# Altium project IMU V1.PrjPcb
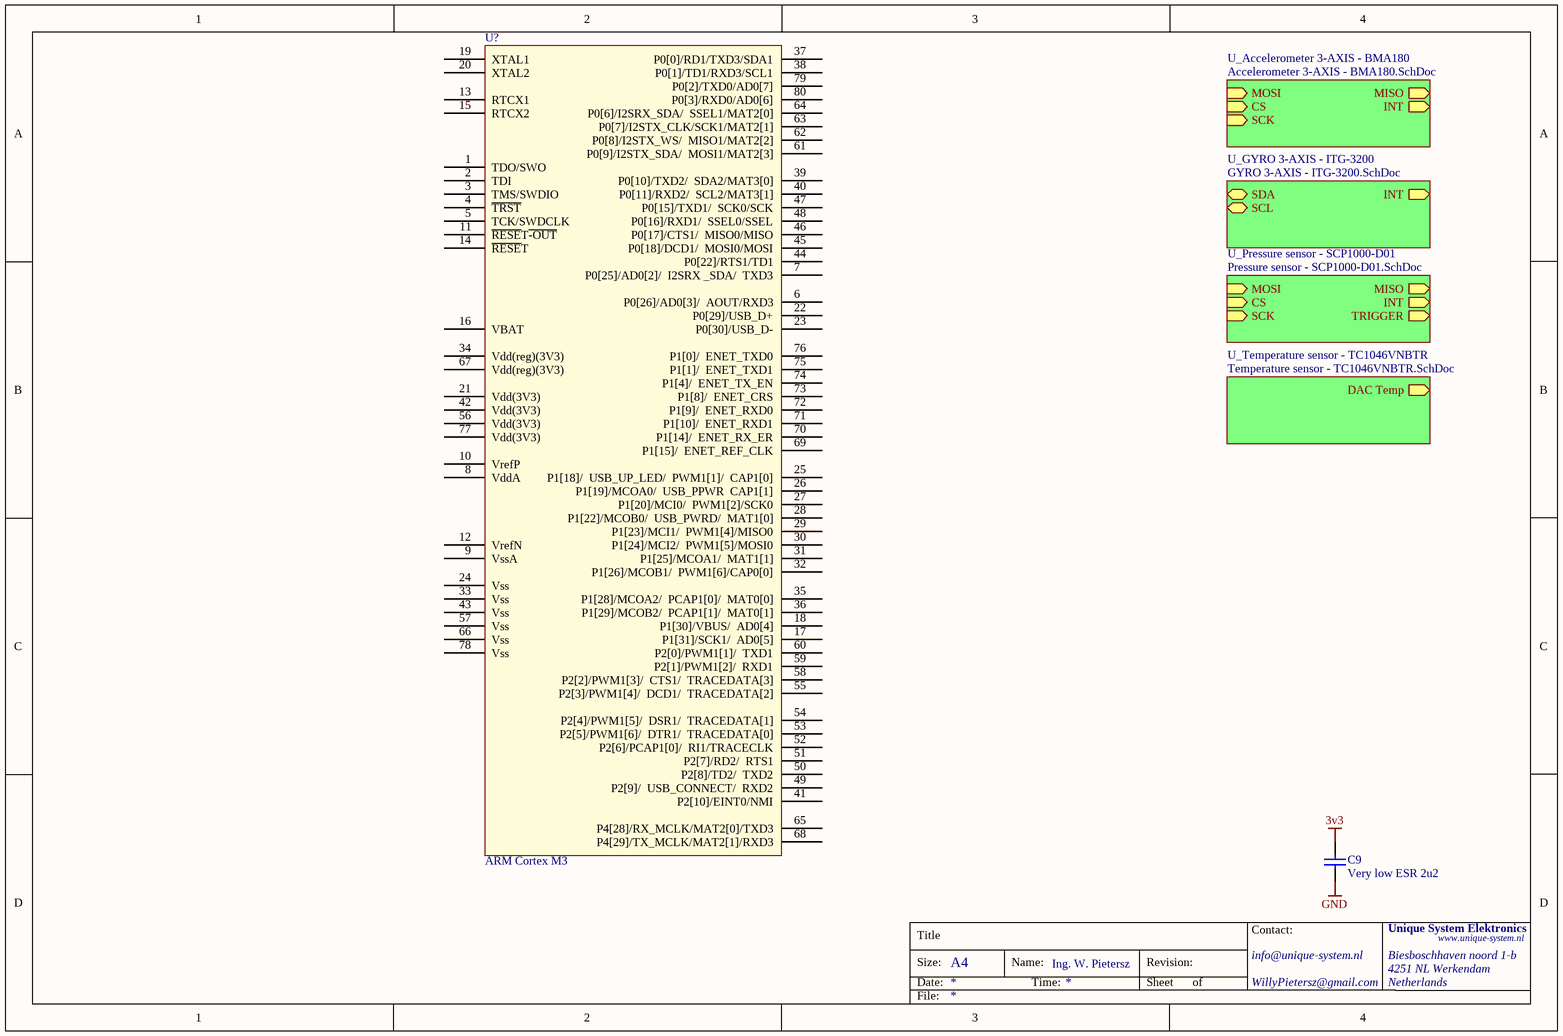
[diagram p0: main.SchDoc]
6 sheets, 16 parts. Net scope: hierarchical (ports join the sheet entries above them; power ports are global).
Board file: IMU V1.PcbDoc
Sheets:
  main.SchDoc
    U_GYRO 3-AXIS - ITG-3200 = GYRO 3-AXIS - ITG-3200.SchDoc
    U_Pressure sensor - SCP1000-D01 = Pressure sensor - SCP1000-D01.SchDoc
    U_Temperature sensor - TC1046VNBTR = Temperature sensor - TC1046VNBTR.SchDoc
  Zigbee interface.SchDoc
  JTAG Connector.SchDoc

## Sheet main.SchDoc
size A4; Organization: Altium Limited; Address1: 3 Minna Close; Address2: Belrose; Address3: NSW 2085; Address4: Australia

### Parts
(Parts that share a designator on the sheet are numbered #1, #2 ... from top to bottom, then left to right.)
C9  Very low ESR 2u2  [C1210]
U?#1  ARM Cortex M3  [LQFP80]

### Sub-sheets
U_Accelerometer 3-AXIS - BMA180 = Accelerometer 3-AXIS - BMA180.SchDoc (file not in this document): MOSI (in), MISO (out), CS (in), SCK (in), INT (out)
U_GYRO 3-AXIS - ITG-3200 = GYRO 3-AXIS - ITG-3200.SchDoc: SDA (bidir), SCL (bidir), INT (out)
U_Pressure sensor - SCP1000-D01 = Pressure sensor - SCP1000-D01.SchDoc: MOSI (in), MISO (out), CS (in), SCK (in), INT (out), TRIGGER (out)
U_Temperature sensor - TC1046VNBTR = Temperature sensor - TC1046VNBTR.SchDoc: DAC Temp (out)

### Nets
3v3: C9.2
GND: C9.1

Not connected (* = marked no-connect by the designer): U?#1 1(TDO/SWO) 2(TDI) 3(TMS/SWDIO) 4(~{TRST}) 5(TCK/SWDCLK) 6(P0[26]/AD0[3]/__AOUT/RXD3) 7(P0[25]/AD0[2]/__I2SRX__SDA/__TXD3) 8(VddA) 9(VssA) 10(VrefP) 11(~{RESE}T~{-OUT}) 12(VrefN) 13(RTCX1) 14(~{RESE}T) 15(RTCX2) 16(VBAT) 17(P1[31]/SCK1/__AD0[5]) 18(P1[30]/VBUS/__AD0[4]) 19(XTAL1) 20(XTAL2) 21(Vdd(3V3)) 22(P0[29]/USB_D+) 23(P0[30]/USB_D-) 24(Vss) 25(P1[18]/__USB_UP_LED/__PWM1[1]/__CAP1[0]) 26(P1[19]/MCOA0/__USB_PPWR__CAP1[1]) 27(P1[20]/MCI0/__PWM1[2]/SCK0) 28(P1[22]/MCOB0/__USB_PWRD/__MAT1[0]) 29(P1[23]/MCI1/__PWM1[4]/MISO0) 30(P1[24]/MCI2/__PWM1[5]/MOSI0) 31(P1[25]/MCOA1/__MAT1[1]) 32(P1[26]/MCOB1/__PWM1[6]/CAP0[0]) 33(Vss) 34(Vdd(reg)(3V3)) 35(P1[28]/MCOA2/__PCAP1[0]/__MAT0[0]) 36(P1[29]/MCOB2/__PCAP1[1]/__MAT0[1]) 37(P0[0]/RD1/TXD3/SDA1) 38(P0[1]/TD1/RXD3/SCL1) 39(P0[10]/TXD2/__SDA2/MAT3[0]) 40(P0[11]/RXD2/__SCL2/MAT3[1]) 41(P2[10]/EINT0/NMI) 42(Vdd(3V3)) 43(Vss) 44(P0[22]/RTS1/TD1) 45(P0[18]/DCD1/__MOSI0/MOSI) 46(P0[17]/CTS1/__MISO0/MISO) 47(P0[15]/TXD1/__SCK0/SCK) 48(P0[16]/RXD1/__SSEL0/SSEL) 49(P2[9]/__USB_CONNECT/__RXD2) 50(P2[8]/TD2/__TXD2) 51(P2[7]/RD2/__RTS1) 52(P2[6]/PCAP1[0]/__RI1/TRACECLK) 53(P2[5]/PWM1[6]/__DTR1/__TRACEDATA[0]) 54(P2[4]/PWM1[5]/__DSR1/__TRACEDATA[1]) 55(P2[3]/PWM1[4]/__DCD1/__TRACEDATA[2]) 56(Vdd(3V3)) 57(Vss) 58(P2[2]/PWM1[3]/__CTS1/__TRACEDATA[3]) 59(P2[1]/PWM1[2]/__RXD1) 60(P2[0]/PWM1[1]/__TXD1) 61(P0[9]/I2STX_SDA/__MOSI1/MAT2[3]) 62(P0[8]/I2STX_WS/__MISO1/MAT2[2]) 63(P0[7]/I2STX_CLK/SCK1/MAT2[1]) 64(P0[6]/I2SRX_SDA/__SSEL1/MAT2[0]) 65(P4[28]/RX_MCLK/MAT2[0]/TXD3) 66(Vss) 67(Vdd(reg)(3V3)) 68(P4[29]/TX_MCLK/MAT2[1]/RXD3) 69(P1[15]/__ENET_REF_CLK) 70(P1[14]/__ENET_RX_ER) 71(P1[10]/__ENET_RXD1) 72(P1[9]/__ENET_RXD0) 73(P1[8]/__ENET_CRS) 74(P1[4]/__ENET_TX_EN) 75(P1[1]/__ENET_TXD1) 76(P1[0]/__ENET_TXD0) 77(Vdd(3V3)) 78(Vss) 79(P0[2]/TXD0/AD0[7]) 80(P0[3]/RXD0/AD0[6])

### Notes on the sheet
- Title
- Size:
- Date:
- A4
- Name:
- Time:
- Ing. W. Pietersz
- Revision:
- Sheet
- of
- WillyPietersz@gmail.com
- Contact:
- info@unique-system.nl
- Unique System Elektronics
- Biesboschhaven noord 1-b
- 4251 NL Werkendam
- Netherlands
- www.unique-system.nl
- File:

### Library data of the parts
C9 = 2.2uF-1210-X7R: Voltage: 50V; Type: X7R; Tolerance: 0.1; Part Number: 2.2uF-1210-X7R; Value: 2.2uF-1210-X7R; Package: 1210; Component Type: Low ESR; LatestRevision Date: 14-9-2010; Author: Willem Pietersz; Supplier 2: Farnell; Supplier Part Number 2: 1414066
U?#1 = LPC175x: Part Number: LPC175x; Component Type: UC, ARM; Supplier 2: Farnell; Supplier Part Number 2: 1718541; ComponentLink1Description: Datasheet; ComponentLink1URL: http://www.nxp.com/acrobat/datasheets/LPC1758_56_54_52_51_2.pdf

## Sheet GYRO 3-AXIS - ITG-3200.SchDoc
size A4; Organization: Altium Limited; Address1: 3 Minna Close; Address2: Belrose; Address3: NSW 2085; Address4: Australia
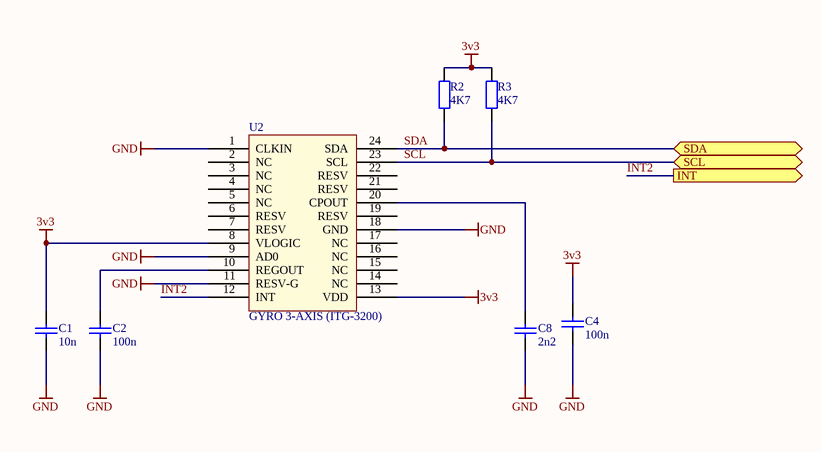
[diagram p1: GYRO 3-AXIS - ITG-3200.SchDoc]

### Parts
C1  10n  [C0805]
C2  100n  [C0805]
C4  100n  [C0805]
C8  2n2  [C0805]
R2  value 4K7  [R0805]  (hidden comment: RESISTOR)
R3  value 4K7  [R0805]  (hidden comment: RESISTOR)
U2  GYRO 3-AXIS (ITG-3200)  [QFN50P400X400-24V2M - GYRO 3axis]

### Ports
INT (out), SCL (bidir), SDA (bidir)

### Nets
3v3: C1.2 C4.2 R2.1 R3.1 U2.8(VLOGIC) U2.13(VDD)
GND: C1.1 C2.1 C4.1 C8.1 U2.1(CLKIN) U2.9(AD0) U2.11(RESV-G) U2.18(GND)
INT2: U2.12(INT) ; port INT
SCL: R3.2 U2.23(SCL) ; port SCL
SDA: R2.2 U2.24(SDA) ; port SDA
NetC2_2: C2.2 U2.10(REGOUT)
NetC8_2: C8.2 U2.20(CPOUT)

Not connected (* = marked no-connect by the designer): U2 2(NC) 3(NC) 4(NC) 5(NC) 6(RESV) 7(RESV) 14(NC) 15(NC) 16(NC) 17(NC) 19(RESV) 21(RESV) 22(RESV)

### Notes on the sheet
- Title
- Size:
- Date:
- A4
- Name:
- Time:
- Ing. W. Pietersz
- Revision:
- Sheet
- of
- WillyPietersz@gmail.com
- Contact:
- info@unique-system.nl
- Unique System Elektronics
- Biesboschhaven noord 1-b
- 4251 NL Werkendam
- Netherlands
- www.unique-system.nl
- File:

### Library data of the parts
C1 = 10n: Tolerance: 0.1; LatestRevision Note: Initial Release; Part Number: 10n; Value: 10n; Package: 0805; Component Type: Standard; LatestRevision Date: 31-7-2010; Author: Willy Pietersz; ComponentLink1Description: Manufacturer; ComponentLink2Description: Datasheet
C2 C4 = 100n: Tolerance: 0.1; LatestRevision Note: Initial Release; Part Number: 100n; Value: 100n; Package: 0805; Component Type: Standard; LatestRevision Date: 31-7-2010; Author: Willy Pietersz; Supplier 2: Farnell; Supplier Part Number 2: 1759266; ComponentLink1Description: Manufacturer; ComponentLink2Description: Datasheet
C8 = 2n2: Tolerance: 0.1; LatestRevision Note: Initial Release; Part Number: 2n2; Value: 2n2; Package: 0805; Component Type: Standard; LatestRevision Date: 31-7-2010; Author: Willy Pietersz; ComponentLink1Description: Manufacturer; ComponentLink2Description: Datasheet
R2 R3 = 4K7: Manufacturer 1: Panasonic; Manufacturer 1 Part No: ERJT06J472V; Power: 0.25W; Tolerance: 0.05; LatestRevision Note: Initial Release; Published: 8-Jun-2000; LatestRevisionDate: 17-Jul-2002; LatestRevisionNote: Re-released for DXP Platform.; PackageReference: AXIAL-0.4; Publisher: Altium Limited; Part Number: 4K7; Type: Film; Package: 0805; Component Type: Standard; LatestRevision Date: 30-7-2010; Author: Willy Pietersz; ROHS: Y; Supplier 2: Farnell; Supplier Part Number 2: 1577368; ComponentLink1Description: Manufacturer; ComponentLink2Description: Datasheet
U2 = ITG-3200: Gyro, 3-axis; Part Number: ITG-3200; Component Type: Sensor; Supplier 1: Sparkfun; Supplier Part Number 1: ITG-3200; ComponentLink1Description: Datasheet; ComponentLink1URL: http://www.sparkfun.com/datasheets/Sensors/Gyro/PS-ITG-3200-00-01.4.pdf

## Sheet Pressure sensor - SCP1000-D01.SchDoc
size A4; Organization: Altium Limited; Address1: 3 Minna Close; Address2: Belrose; Address3: NSW 2085; Address4: Australia
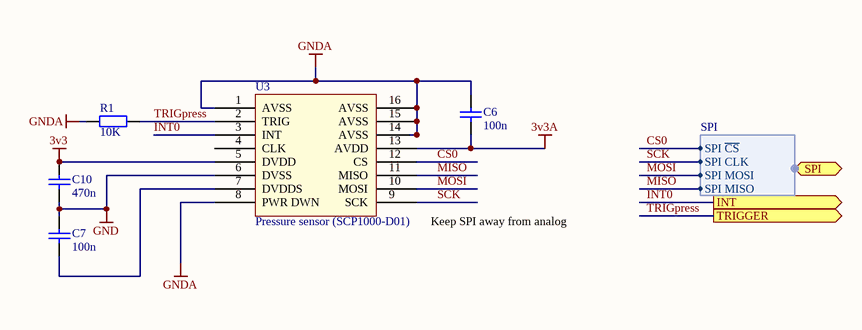
[diagram p2: Pressure sensor - SCP1000-D01.SchDoc]

### Parts
C6  100n  [C0805]
C7  100n  [C0805]
C10  470n  [C0805]
R1  value 10K  [R0805]  (hidden comment: RESISTOR)
U3  Pressure sensor (SCP1000-D01)  [SCP1000-D01]

### Ports
INT (out), SPI (harness SPI), TRIGGER (out)

### Harnesses
SPI: SPI ~{CS}, SPI CLK, SPI MOSI, SPI MISO

### Nets
3v3: C10.2 U3.5(DVDD)
3v3A: C6.1 U3.13(AVDD)
GND: C7.2 C10.1 U3.6(DVSS)
GNDA: C6.2 R1.1 U3.1(AVSS) U3.8(PWR_DWN) U3.14(AVSS) U3.15(AVSS) U3.16(AVSS)
CS0: U3.12(CS) ; port SPI.SPI ~{CS}
INT0: U3.3(INT) ; port INT
MISO: U3.11(MISO) ; port SPI.SPI MISO
MOSI: U3.10(MOSI) ; port SPI.SPI MOSI
SCK: U3.9(SCK) ; port SPI.SPI CLK
TRIGpress: R1.2 U3.2(TRIG) ; port TRIGGER
NetC7_1: C7.1 U3.7(DVDDS)

Not connected (* = marked no-connect by the designer): U3 4(CLK)

### Notes on the sheet
- Keep SPI away from analog
- Title
- Size:
- Date:
- A4
- Name:
- Time:
- Ing. W. Pietersz
- Revision:
- Sheet
- of
- WillyPietersz@gmail.com
- Contact:
- info@unique-system.nl
- Unique System Elektronics
- Biesboschhaven noord 1-b
- 4251 NL Werkendam
- Netherlands
- www.unique-system.nl
- File:

### Library data of the parts
C6 C7 = 100n: as C2 on sheet GYRO 3-AXIS - ITG-3200; Part Number: 100n; Value: 100n; Package: 0805; Component Type: Standard; LatestRevision Date: 31-7-2010; Author: Willy Pietersz; Supplier 2: Farnell; Supplier Part Number 2: 1759266; ComponentLink1Description: Manufacturer; ComponentLink2Description: Datasheet
C10 = 470n: Tolerance: 0.1; LatestRevision Note: Initial Release; Part Number: 470n; Value: 470n; Package: 0805; Component Type: Standard; LatestRevision Date: 31-7-2010; Author: Willy Pietersz; ComponentLink1Description: Manufacturer; ComponentLink2Description: Datasheet
R1 = 10K: Manufacturer 1: Panasonic; Manufacturer 1 Part No: ERJT06J103V; Power: 0.25W; Tolerance: 0.05; LatestRevision Note: Initial Release; Published: 8-Jun-2000; LatestRevisionDate: 17-Jul-2002; LatestRevisionNote: Re-released for DXP Platform.; PackageReference: AXIAL-0.4; Publisher: Altium Limited; Part Number: 10K; Type: Film; Package: 0805; Component Type: Standard; LatestRevision Date: 30-7-2010; Author: Willy Pietersz; ROHS: Y; Supplier 2: Farnell; Supplier Part Number 2: 1618242; ComponentLink1Description: Manufacturer; ComponentLink2Description: Datasheet
U3 = SCP1000-D01: Part Number: SCP1000-D01; Component Type: Sensor; Supplier 1: Sparkfun; Supplier Part Number 1: SCP1000-D01; ComponentLink1Description: Datasheet; ComponentLink1URL: http://www.sparkfun.com/datasheets/Components/SCP1000-D01.pdf

## Sheet Temperature sensor - TC1046VNBTR.SchDoc
size A4; Organization: Altium Limited; Address1: 3 Minna Close; Address2: Belrose; Address3: NSW 2085; Address4: Australia
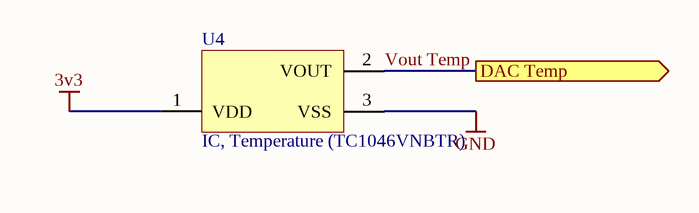
[diagram p3: Temperature sensor - TC1046VNBTR.SchDoc]

### Parts
U4  IC, Temperature (TC1046VNBTR)  [SOT-23-NB3_M]

### Ports
DAC Temp (out)

### Nets
3v3: U4.1(VDD)
GND: U4.3(VSS)
Vout Temp: U4.2(VOUT) ; port DAC Temp

### Notes on the sheet
- Title
- Size:
- Date:
- A4
- Name:
- Time:
- Ing. W. Pietersz
- Revision:
- Sheet
- of
- WillyPietersz@gmail.com
- Contact:
- info@unique-system.nl
- Unique System Elektronics
- Biesboschhaven noord 1-b
- 4251 NL Werkendam
- Netherlands
- www.unique-system.nl
- File:

### Library data of the parts
U4 = TC1046VNBTR: High Precision Temperature-to-Voltage Converter, 3-Pin SOT-23, Extended Temperature, Tape and Reel; FirstPublished: 29-Jan-2009; DatasheetVersion: revB, Feb-2003; PackageVersion: revBB, Aug-2009; PackageReference: SOT-23-NB3; Publisher: Altium Limited; PackageDescription: 3-Lead Plastic Small Outline Transistor (NB) [SOT-23]; Supplier 1: Digi-Key; Supplier Part Number 1: TC1046VNBTRTR-ND; Supplier 2: Digi-Key; Supplier Part Number 2: TC1046VNBTRCT-ND; Supplier 3: Digi-Key; Supplier Part Number 3: TC1046VNBTRDKR-ND; Supplier 4: Farnell; Supplier Part Number 4: 1212685; Supplier 5: Newark; Supplier Part Number 5: 89C8092; Code_IPC: SOT23-3; ComponentLink1Description: Datasheet; ComponentLink1URL: http://ww1.microchip.com/downloads/en/DeviceDoc/21496b.pdf; ComponentLink2Description: Packaging Specification; ComponentLink2URL: http://www.microchip.com/stellent/groups/techpub_sg/documents/packagingspec/en012702.pdf; ComponentLink3Description: Microchip.com Home; ComponentLink3URL: http://www.microchip.com/

## Sheet Zigbee interface.SchDoc
size A4; Organization: Altium Limited; Address1: 3 Minna Close; Address2: Belrose; Address3: NSW 2085; Address4: Australia
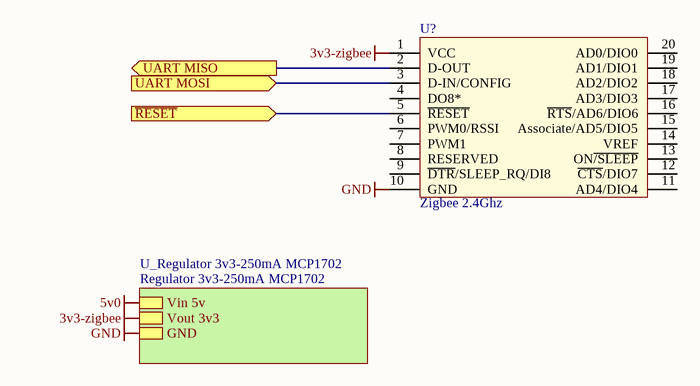
[diagram p4: Zigbee interface.SchDoc]

### Parts
(Parts that share a designator on the sheet are numbered #1, #2 ... from top to bottom, then left to right.)
U?#2  Zigbee 2.4Ghz  [Zigbee_maxstream]

### Sub-sheets
U_Regulator 3v3-250mA MCP1702 = Regulator 3v3-250mA MCP1702 (file not in this document): Vin 5v, Vout 3v3, GND

### Ports
UART MISO (out), UART MOSI (in), ~{RESET} (in)

### Nets
3v3-zigbee: U?#2.1(VCC) ; sheet U_Regulator 3v3-250mA MCP1702/Vout 3v3
5v0: sheet U_Regulator 3v3-250mA MCP1702/Vin 5v
GND: U?#2.10(GND) ; sheet U_Regulator 3v3-250mA MCP1702/GND
NetU?#2_2: U?#2.2(D-OUT) ; port UART MISO
NetU?#2_3: U?#2.3(D-IN/CONFIG) ; port UART MOSI
NetU?#2_5: U?#2.5(~{RESET}) ; port ~{RESET}

Not connected (* = marked no-connect by the designer): U?#2 4(DO8*) 6(PWM0/RSSI) 7(PWM1) 8(RESERVED) 9(~{DTR}/SLEEP_RQ/DI8) 11(AD4/DIO4) 12(~{CTS}/DIO7) 13(ON~{/SLEEP}) 14(VREF) 15(Associate/AD5/DIO5) 16(~{RTS}/AD6/DIO6) 17(AD3/DIO3) 18(AD2/DIO2) 19(AD1/DIO1) 20(AD0/DIO0)

### Notes on the sheet
- Title
- Size:
- Date:
- A4
- Name:
- Time:
- Ing. W. Pietersz
- Revision:
- Sheet
- of
- WillyPietersz@gmail.com
- Contact:
- info@unique-system.nl
- Unique System Elektronics
- Biesboschhaven noord 1-b
- 4251 NL Werkendam
- Netherlands
- www.unique-system.nl
- File:

### Library data of the parts
U?#2 = Zigbee-WRL-08690: Wireless, zigbee module from Maxstream;; Part Number: Zigbee-WRL-08690; Component Type: Wireless, Zigbee; ComponentLink1Description: Datasheet; ComponentLink1URL: http://www.sparkfun.com/datasheets/Wireless/Zigbee/XBee-Datasheet.pdf

## Sheet JTAG Connector.SchDoc
size A4; Organization: Altium Limited; Address1: 3 Minna Close; Address2: Belrose; Address3: NSW 2085; Address4: Australia
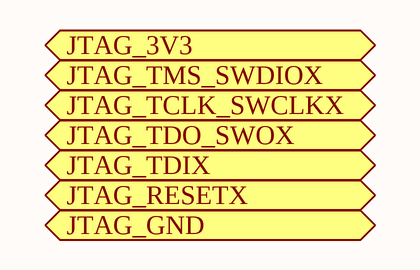
[diagram p5: JTAG Connector.SchDoc]

### Ports
JTAG_3V3, JTAG_GND, JTAG_RESETX (in), JTAG_TCLK_SWCLKX (in), JTAG_TDIX (in), JTAG_TDO_SWOX (in), JTAG_TMS_SWDIOX (in)

### Notes on the sheet
- Title
- Size:
- Date:
- A4
- Name:
- Time:
- Ing. W. Pietersz
- Revision:
- Sheet
- of
- WillyPietersz@gmail.com
- Contact:
- info@unique-system.nl
- Unique System Elektronics
- Biesboschhaven noord 1-b
- 4251 NL Werkendam
- Netherlands
- www.unique-system.nl
- File:

## Nets that join several sheets
3v3: main (C9.2), GYRO 3-AXIS - ITG-3200 (6 pins), Pressure sensor - SCP1000-D01 (C10.2 U3.5), Temperature sensor - TC1046VNBTR (U4.1)
GND: main (C9.1), GYRO 3-AXIS - ITG-3200 (8 pins), Pressure sensor - SCP1000-D01 (C7.2 C10.1 U3.6), Temperature sensor - TC1046VNBTR (U4.3), Zigbee interface (U?#2.10)